# Altium schematic sheet Relay.SchDoc
size A4; SheetNumber: 2; SheetTotal: 2; SPICEModelCachePKTNKTAD: <root> / <DocumentId>PKTNKTAD</DocumentId> / <CacheFrame Number="0"> / <Model Name="3mm_151033bs03000" Kind="CKT"> / <Text>************************************************** / * Manufacturer:           Wurth Elektronik / * Kinds:                  THT Mono-color Round Waterclear / * Matchcode:              WL-TMRW / * Library Type:           LTspice / * Version:                rev22a / * Created/modified by:    Ella / * Date and Time:          2022-02-23 / * Team:                   eiSos EDA Service / * Contact:                libraries@we-online.com / ************************************************** / * Copyright(C) 2022 WÃ¼rth Elektronik eiSos GmbH &amp; Co. KG / * All Rights Reserved. / ************************************************** / * Disclaimer: While WÃ¼rth Elektronik eiSos has made every reasonable effort to ensure the accuracy / * of the simulation models provided, WÃ¼rth Elektronik eiSos does not guarantee the exemption of error on / * the simulation models, nor does WÃ¼rth Elektronik eiSos guarantee that the simulation model is current. / * WÃ¼rth Elektronik eiSos reserves the right to make any adjustments at any time without notice. / * WÃ¼rth Elektronik eiSos expressly disclaims all implied warranties regarding this simulation model. / ************************************************** / .subckt 3mm_151033BS03000  1  2 / D1 1 2 TMRW / .MODEL TMRW D / + IS=273.29E-18 / + N=2.9601 / + RS=1.0279 / + IKF=191.62E-6 / + CJO=1.0000E-12 / + M=.3333 / + VJ=.75 / + BV=5 / + IBV=50.00E-6 / + TT=5.0000E-9 / .ends</Text> / </Model> / </CacheFrame> / </root>
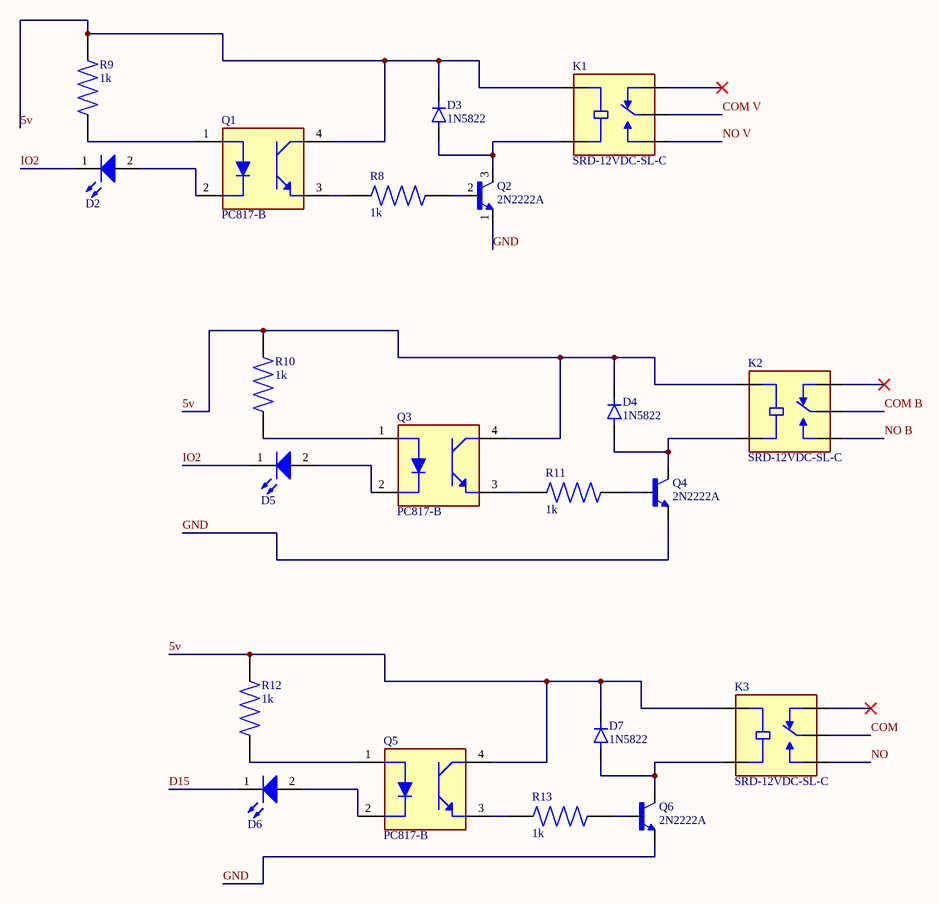
[diagram p0: Relay.SchDoc]

## Parts
D2  Blue, 2.8V, 30°  [WL-TMRW_D3.9H10.5]  (value not drawn)
D3  1N5822  [DIOAD1990W125L900D530]
D4  1N5822  [DIOAD1990W125L900D530]
D5  Blue, 2.8V, 30°  [WL-TMRW_D3.9H10.5]  (value not drawn)
D6  Blue, 2.8V, 30°  [WL-TMRW_D3.9H10.5]  (value not drawn)
D7  1N5822  [DIOAD1990W125L900D530]
K1  SRD-12VDC-SL-C  [RELAY_SRD-12VDC-SL-C]
K2  SRD-12VDC-SL-C  [RELAY_SRD-12VDC-SL-C]
K3  SRD-12VDC-SL-C  [RELAY_SRD-12VDC-SL-C]
Q1  PC817-B  [PC817]
Q2  2N2222A  [2N2222A - 1]
Q3  PC817-B  [PC817]
Q4  2N2222A  [2N2222A - 1]
Q5  PC817-B  [PC817]
Q6  2N2222A  [2N2222A - 1]
R8  1k  [RESC2012X60N]
R9  1k  [RESC2012X60N]
R10  1k  [RESC2012X60N]
R11  1k  [RESC2012X60N]
R12  1k  [RESC2012X60N]
R13  1k  [RESC2012X60N]

## Nets
5v: D3.C(K) D4.C(K) D7.C(K) K1.COIL1 K2.COIL1 K3.COIL1 Q1.4(COLLECTOR) Q3.4(COLLECTOR) Q5.4(COLLECTOR) R9.1 R10.1 R12.1
COM: K3.COM
COM B: K2.COM
COM V: K1.COM
D15: D6.1(K)
GND: Q2.1(E) Q4.1(E) Q6.1(E)
IO2: D2.1(K) D5.1(K)
NO: K3.NO
NO B: K2.NO
NO V: K1.NO
NetD2_2: D2.2(A) Q1.2(CATHODE)
NetD3_A: D3.A K1.COIL2 Q2.3(C)
NetD4_A: D4.A K2.COIL2 Q4.3(C)
NetD5_2: D5.2(A) Q3.2(CATHODE)
NetD6_2: D6.2(A) Q5.2(CATHODE)
NetD7_A: D7.A K3.COIL2 Q6.3(C)
NetQ1_1: Q1.1(ANODE) R9.2
NetQ1_3: Q1.3(EMITTER) R8.1
NetQ2_2: Q2.2(B) R8.2
NetQ3_1: Q3.1(ANODE) R10.2
NetQ3_3: Q3.3(EMITTER) R11.1
NetQ4_2: Q4.2(B) R11.2
NetQ5_1: Q5.1(ANODE) R12.2
NetQ5_3: Q5.3(EMITTER) R13.1
NetQ6_2: Q6.2(B) R13.2

Not connected (* = marked no-connect by the designer): K1 NC*; K2 NC*; K3 NC*

## Library data of the parts
D2 D5 D6 = 151033BS03000: WL-TMRW Mono-color Round Waterclear, THT, D3.9 x H10.5mm, Blue, 2.8V, 30°; Manufacturer: Wurth Elektronik; Chip Technology: InGaN; Dominant Wavelength: 470nm; Luminous Intensity: 3800mcd; Peak Wavelength: 465nm; Manufacturer Part Number: 151033BS03000; Category: Signal LEDs; Match Code: WL-TMRW; ComponentLink1Description: Website Link; ComponentLink1URL: https://www.we-online.com/redexpert/article/151033BS03000?ad; ComponentLink2Description: Datasheet Link; ComponentLink2URL: https://www.we-online.com/redexpert/spec/151033BS03000?ad; Mount: Through Hole; Operating Temperature Max: 85°C; Operating Temperature Min: -40°C; Packaging: Bulk; Height: 10.5mm; Diameter: 3.9mm; Emitting Color: Blue; Forward Voltage: 2.8V; Viewing Angle: 30°
D3 D4 D7 = 1N5822: 3A, 40V, Planar Schottky; MF: Taiwan Semiconductor; SnapEDA_Link: https://www.snapeda.com/parts/1N5822/taiwan/view-part/?ref=snap; Package: DO-201AD Taiwan Semiconductor; Value: *; MP: 1N5822; Check_prices: https://www.snapeda.com/parts/1N5822/taiwan/view-part/?ref=eda
K1-K3 = SRD-12VDC-SL-C: General Purpose Non Latching 12VDC SPDT Through Hole Relays RoHS; MF: Songle Relay; SnapEDA_Link: https://www.snapeda.com/parts/SRD-12VDC-SL-C/Songle+Relay/view-part/?ref=snap; Package: NON STANDARD-5 Songle Relay; Value: *; MP: SRD-12VDC-SL-C; Check_prices: https://www.snapeda.com/parts/SRD-12VDC-SL-C/Songle+Relay/view-part/?ref=eda
Q1 Q3 Q5 = PC817-B: Phototransistors 4-DIP (0.300, 7.62mm); MF: American Bright; SnapEDA_Link: https://www.snapeda.com/parts/PC817-B/American+Bright/view-part/?ref=snap; Package: DIP-4 American Bright; Value: *; MP: PC817-B; Check_prices: https://www.snapeda.com/parts/PC817-B/American+Bright/view-part/?ref=eda
Q2 Q4 Q6 = 2N2222A: BJT, TO-92, 40V, 600mA, NPN, 0.625W, 150Â°C; MF: Diotec Semiconductor; SnapEDA_Link: https://www.snapeda.com/parts/2N2222A/Diotec/view-part/?ref=snap; Package: TO-92 Diotec; Value: *; MP: 2N2222A; Check_prices: https://www.snapeda.com/parts/2N2222A/Diotec/view-part/?ref=eda
R8-R13 = RC0805FR-07910RL: 910 Ohms Â±1% 0.125W, 1/8W Chip Resistor 0805 (2012 Metric) Moisture Resistant Thick Film; MF: Yageo; Package: 2012 Rohm Semiconductor; Value: *; Purchase-URL: https://pricing.snapeda.com/search/part/RC0805FR-07910RL/?ref=eda; Availability: In Stock; MP: RC0805FR-07910RL; Price: None